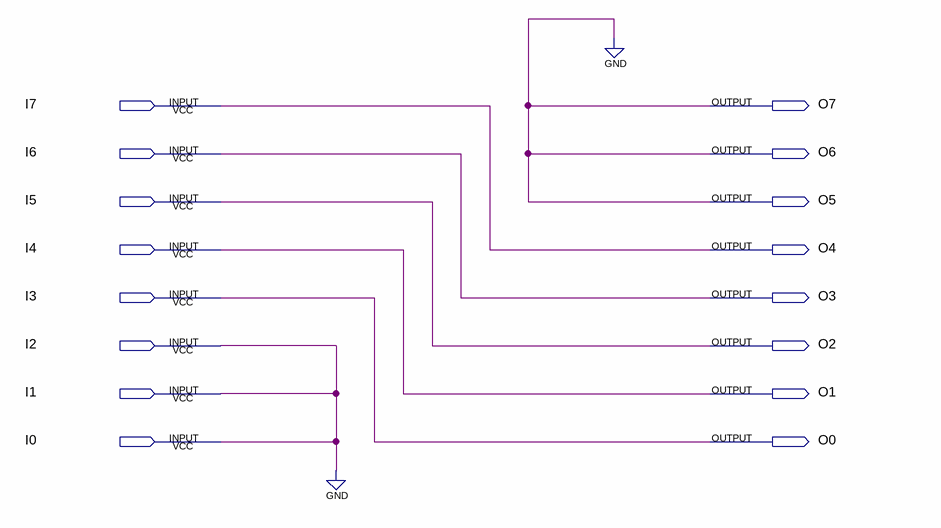
[diagram p0: schematic sheet]
// Quartus schematic RS_3BIT.bdf as structural Verilog: 0 symbols, 16 pins
module RS_3BIT (
  input  I7,
  input  I6,
  input  I5,
  input  I4,
  input  I3,
  input  I2,
  input  I1,
  input  I0,
  output O7,
  output O6,
  output O5,
  output O4,
  output O3,
  output O2,
  output O1,
  output O0
);


  assign I1 = I0;
  assign I2 = I0;
  assign O0 = I3;
  assign O1 = I4;
  assign O2 = I5;
  assign O3 = I6;
  assign O4 = I7;
  assign O5 = 1'b0;
  assign O6 = 1'b0;
  assign O7 = 1'b0;
  // also tied to GND on the sheet: I0
endmodule
